# EasyEDA Pro project ProPrj_ESP32SoundBoard_2026-02-01.epro, schematic ESP32SoundBoard
Board Name: Board1; Create Date: 2026-01-03; Page Name: ESP32SoundBoard; Project Name: ESP32SoundBoard; Schematic Name: ESP32SoundBoard; Update Date: 2026-01-17; Page Size: A4; Version: V1.0
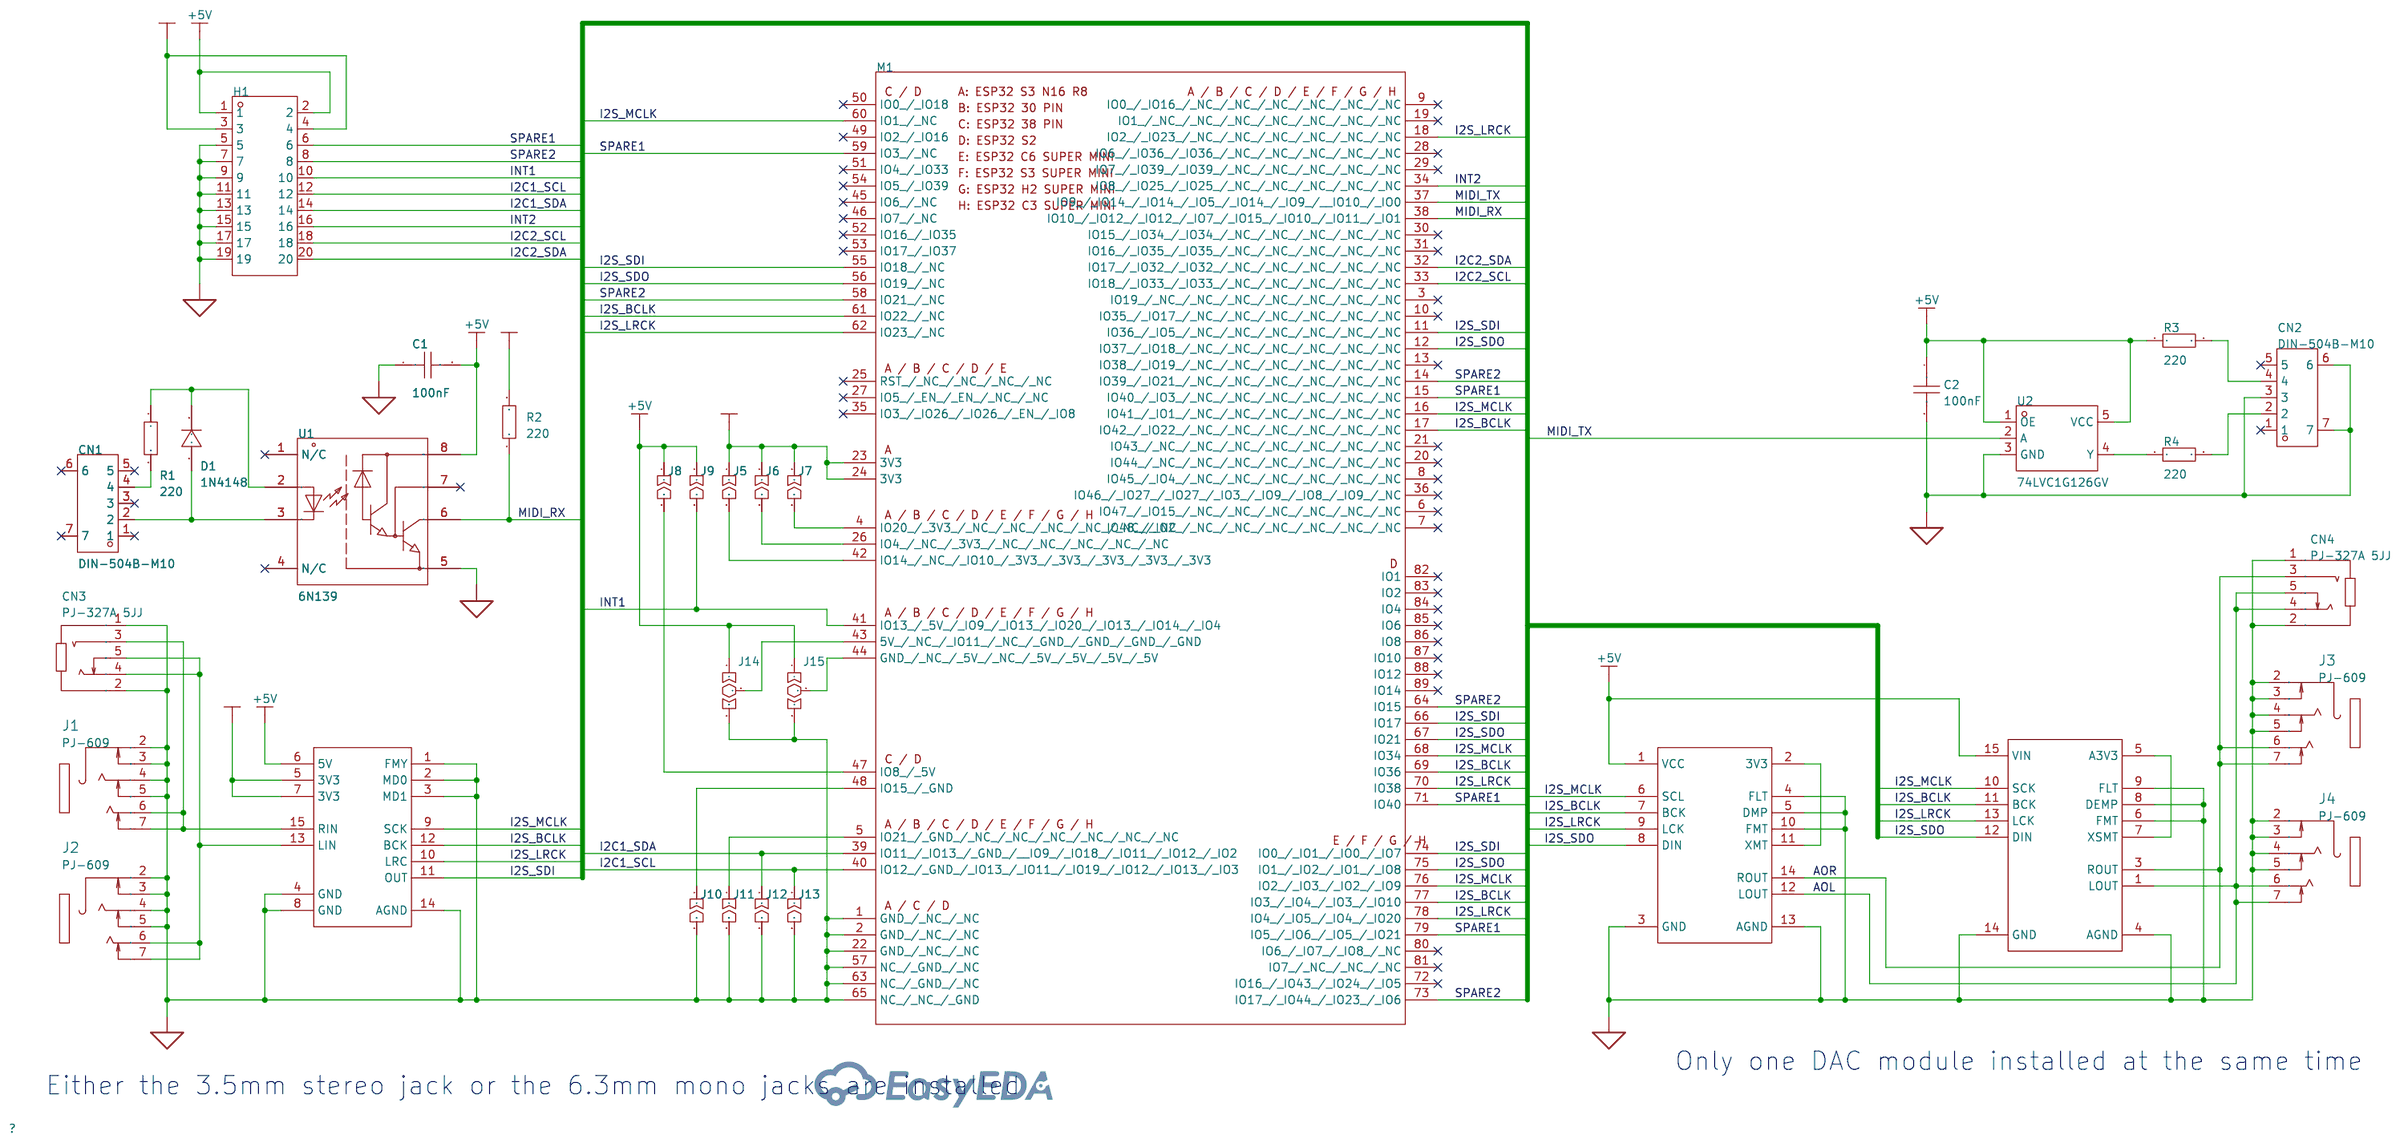
[diagram p0: schematic sheet]

## Parts
C1  100nF  [CAP-TH_L5.5-W2.4-P5.08-D0.6]
C2  100nF  [C0805]
CN1  DIN-504B-M10  [CONN-TH_DIN-504B-M10]
CN2  DIN-504B-M10  [CONN-TH_DIN-504B-M10]
CN3  PJ-327A 5JJ  [AUDIO-SMD_PJ-327A5JJ]
CN4  PJ-327A 5JJ  [AUDIO-SMD_PJ-327A5JJ]
D1  1N4148  [DO-35_BD2.0-L4.0-P8.00-D0.5-FD]
H1  -  [HDR-TH_20P-P2.54-V-M-R2-C10-S2.54]
J1  PJ-609  [AUDIO-TH_PJ-609]
J2  PJ-609  [AUDIO-TH_PJ-609]
J3  PJ-609  [AUDIO-TH_PJ-609]
J4  PJ-609  [AUDIO-TH_PJ-609]
J5  -  [Solder jumper]
J6  -  [Solder jumper]
J7  -  [Solder jumper]
J8  -  [Solder jumper]
J9  -  [Solder jumper]
J10  -  [Solder jumper]
J11  -  [Solder jumper]
J12  -  [Solder jumper]
J13  -  [Solder jumper]
J14  -  [Solder jumper 3 way]
J15  -  [Solder jumper 3 way]
M1  -  [ESP32_DEV_BOARD_MIX]
M2  PCM1808  [PCM1808_ADC_MODULE]
M3  PCM5102  [WCMCU-5102]
M4  PCM5102  [PCM5102_MODULE]
R1  10kΩ  [R_AXIAL-0.4]
R2  10kΩ  [R_AXIAL-0.4]
R3  10kΩ  [R0805]
R4  10kΩ  [R0805]
U1  6N139  [DIP-8_L9.6-W6.4-P2.54-LS7.9-BL]
U2  74LVC1G126GV  [SOT-753_L3.1-W1.7-P0.95-LS3.0-BR]

## Library data of the parts
C1 = CC1H104ZC1FD3F5O1100: Capacitance: Tolerance:-20%~+80% Tolerance:-20%~+80% Voltage Rated: Lead Spacing: Temperature Coefficient: φD: Body Thickness:2.4mm; LCSC Part Name: 100nF -20%~+80% 50V; Supplier Part: C2832508; Manufacturer: Dersonic(德尔创); Supplier Footprint: 插件,P=5.08mm; JLCPCB Part Class: Extended Part; Datasheet: https://atta.szlcsc.com/upload/public/pdf/source/20211027/6BE094CC11F3C85D18CFEA066D7024CD.pdf; Supplier: LCSC; Tolerance: -20%~+80%; Body Thickness: 2.4mm
C2 = CAP_0603: Supplier Footprint: 0603
CN1 CN2 = DIN-504B-M10: Supplier Part: C2939346; Manufacturer: HOOYA(皓宇电子); Supplier Footprint: 插件; JLCPCB Part Class: Extended Part; Datasheet: https://atta.szlcsc.com/upload/public/pdf/source/20220120/ABB2570656C6359DBC61E5C1017AC323.pdf; Supplier: LCSC
CN3 CN4 = PJ-327A 5JJ: Connector Type:3.5mm Headphone Jack Current Rating (Max):500mA Voltage Rating (Max):30V Contact Material:Copper Contact Plating:Gold Operating Temperature Range:-30℃~+70℃ Operating Temperature Range:-30℃~+70℃; LCSC Part Name: 3.5mm耳机座; Supplier Part: C668605; Manufacturer: SHOU HAN(首韩); Supplier Footprint: SMD; JLCPCB Part Class: Extended Part; Datasheet: https://atta.szlcsc.com/upload/public/pdf/source/20200618/C668605_9C1065207AFEF8C715B1238987CF5F80.pdf; Supplier: LCSC; Connector Type: 3.5mm Headphone Jack; Current Rating (Max): 500mA; Voltage Rating (Max): 30V; Contact Material: Copper; Contact Plating: Gold; Operating Temperature Range: -30℃~+70℃
D1 = 1N4148_C258182: Diode Configuration:- Voltage - Forward(Vf@If):1V@10mA Voltage - DC Reverse(Vr):100V Current - Rectified:200mA Reverse Leakage Current (Ir):5uA@75V Reverse Recovery Time (trr):4ns Operating Temperature:-55℃~+175℃@(Tj) Operating Temperature:-55℃~+175℃@(Tj); Supplier Part: C258182; Manufacturer: onsemi(安森美); Supplier Footprint: DO-35; JLCPCB Part Class: Extended Part; Datasheet: https://atta.szlcsc.com/upload/public/pdf/source/20180829/C258182_3EE2D0AB6109C1B72B054FC50B8BC8AD.pdf; Supplier: LCSC; Voltage - Forward(Vf@If): 1V@10mA; Voltage - DC Reverse(Vr): 100V; Current - Rectified: 200mA; Reverse Leakage Current (Ir): 5uA@75V; Reverse Recovery Time (trr): 4ns; Operating Temperature: -55℃~+175℃@(Tj)
H1 = HDR-M_2.54_2x10: Supplier Footprint: Through
J1-J4 = PJ-609: Connector Type:6.35mm耳机座 Current Rating (Max):1A Voltage Rating (Max):50V Operating Temperature Range:-20℃~+70℃ Operating Temperature Range:-20℃~+70℃; LCSC Part Name: 6.35mm耳机座 两件套; Supplier Part: C309274; Manufacturer: HOOYA(皓宇电子); Supplier Footprint: 插件; JLCPCB Part Class: Extended Part; Datasheet: https://atta.szlcsc.com/upload/public/pdf/source/20181226/C309274_AB77CFAA40746E22EC2996DC68F300B9.pdf; Supplier: LCSC; Connector Type: 6.35mm耳机座; Current Rating (Max): 1A; Voltage Rating (Max): 50V; Operating Temperature Range: -20℃~+70℃
J5-J13 = Solder jumper
J14 J15 = Solder jumper 3 way
M1 = ESP32_DEV_BOARD_MIX: Pin layout for a mix of ESP32 development boards that share multiple pins on the same foot print
M2 = PCM1808_ADC_Module: PCM1808 based ADC audio input module
M3 = WCMCU-5102: A PCM5102 based audio DAC module
M4 = PCM5102_Module: PCM5102 based audio DAC module
R1-R4 = Res_AXIAL-1/8W: Supplier Footprint: Through
U1 = 6N139_C5224104: Forward Voltage:1.4V Output Current:60mA Isolation Voltage(rms):5300V Number of Outputs:1 Operating Temperature:-55℃~+100℃ Operating Temperature:-55℃~+100℃; Supplier Part: C5224104; Manufacturer: VISHAY(威世); Supplier Footprint: DIP-8; JLCPCB Part Class: Extended Part; Datasheet: https://atta.szlcsc.com/upload/public/pdf/source/20221031/1E5B59C0BBF2E24895420015CB89D7D7.pdf; Supplier: LCSC; Forward Voltage: 1.4V; Output Current: 60mA; Isolation Voltage(rms): 5300V; Number of Outputs: 1; Operating Temperature: -55℃~+100℃
U2 = 74LVC1G126GV: Supplier Part: C703586; Manufacturer: Nexperia(安世); Supplier Footprint: SOT-753; JLCPCB Part Class: Extended Part; Datasheet: https://atta.szlcsc.com/upload/public/pdf/source/20200715/C703586_E6345225E39094214D3CD308CDCA878C.pdf; Supplier: LCSC

## Nets
3V3: H1.3 H1.4 J5.1 J6.1 J7.1 M1.23(3V3) M1.24(3V3) M2.5(3V3) M2.7(3V3) R2.2
+5V: C1.2 C2.1 H1.1 H1.2 J8.1 J9.1 J14.1 J15.1 M2.6(5V) M3.1(VCC) M4.15(VIN) R3.1 U1.8(VCC) U2.1(OE) U2.5(VCC)
GND: C1.1 C2.2 CN2.3 CN2.6 CN2.7 CN3.1 CN3.2 CN4.1 CN4.2 H1.5 H1.7 H1.9 H1.11 H1.13 H1.15 H1.17 H1.19 J1.2 J1.3 J1.4 J1.5 J2.2 J2.3 J2.4 J2.5 J3.2 J3.3 J3.4 J3.5 J4.2 J4.3 J4.4 J4.5 J10.2 J11.2 J12.2 J13.2 J14.3 J15.3 M1.1(GND / NC / NC) M1.2(GND / NC / NC) M1.22(GND / NC / NC) M1.57(NC / GND / NC) M1.63(NC / GND / NC) M1.65(NC / NC / GND) M2.1(FMY) M2.2(MD0) M2.3(MD1) M2.4(GND) M2.8(GND) M2.14(AGND) M3.3(GND) M3.4(FLT) M3.5(DMP) M3.10(FMT) M3.13(AGND) M4.4(AGND) M4.6(FMT) M4.8(DEMP) M4.9(FLT) M4.14(GND) U1.5(GND) U2.3(GND)
AOL: CN4.4 CN4.5 J4.6 J4.7 M3.12(LOUT) M4.1(LOUT)
AOR: CN4.3 J3.6 J3.7 M3.14(ROUT) M4.3(ROUT)
I2C1_SCL: H1.12 J13.1 M1.40(IO12 / GND / IO13 / IO11 / IO19 / IO12 / IO13 / IO3)
I2C1_SDA: H1.14 J12.1 M1.39(IO11 / IO13 / GND /  IO9 / IO18 / IO11 / IO12 / IO2)
I2C2_SCL: H1.18 M1.33(IO18 / IO33 / IO33 / NC / NC / NC / NC / NC)
I2C2_SDA: H1.20 M1.32(IO17 / IO32 / IO32 / NC / NC / NC / NC / NC)
I2S_BCLK: M1.17(IO42 / IO22 / NC / NC / NC / NC / NC / NC) M1.61(IO22 / NC) M1.69(IO36) M1.77(IO3 / IO4 / IO3 / IO10) M2.12(BCK) M3.7(BCK) M4.11(BCK)
I2S_LRCK: M1.18(IO2 / IO23 / NC / NC / NC / NC / NC / NC) M1.62(IO23 / NC) M1.70(IO38) M1.78(IO4 / IO5 / IO4 / IO20) M2.10(LRC) M3.9(LCK) M4.13(LCK)
I2S_MCLK: M1.16(IO41 / IO1 / NC / NC / NC / NC / NC / NC) M1.60(IO1 / NC) M1.68(IO34) M1.76(IO2 / IO3 / IO2 / IO9) M2.9(SCK) M3.6(SCL) M4.10(SCK)
I2S_SDI: M1.11(IO36 / IO5 / NC / NC / NC / NC / NC / NC) M1.55(IO18 / NC) M1.66(IO17) M1.74(IO0 / IO1 / IO0 / IO7) M2.11(OUT)
I2S_SDO: M1.12(IO37 / IO18 / NC / NC / NC / NC / NC / NC) M1.56(IO19 / NC) M1.67(IO21) M1.75(IO1 / IO2 / IO1 / IO8) M3.8(DIN) M4.12(DIN)
INT1: H1.10 J9.2 M1.41(IO13 / 5V / IO9 / IO13 / IO20 / IO13 / IO14 / IO4)
INT2: H1.16 M1.34(IO8 / IO25 / IO25 / NC / NC / NC / NC / NC)
MIDI_RX: M1.38(IO10 / IO12 / IO12 / IO7 / IO15 / IO10 / IO11 / IO1) R2.1 U1.6(VO)
MIDI_TX: M1.37(IO9 / IO14 / IO14 / IO5 / IO14 / IO9 /  IO10 / IO0) U2.2(A)
SPARE1: H1.6 M1.15(IO40 / IO3 / NC / NC / NC / NC / NC / NC) M1.59(IO3 / NC) M1.71(IO40) M1.79(IO5 / IO6 / IO5 / IO21)
SPARE2: H1.8 M1.14(IO39 / IO21 / NC / NC / NC / NC / NC / NC) M1.58(IO21 / NC) M1.64(IO15) M1.73(IO17 / IO44 / IO23 / IO6)
$1N8448: D1.2(K) R1.1 U1.2(VF+)
$1N8617: R4.1 U2.4(Y)
$1N9304: CN1.4 R1.2
$1N9313: CN1.2 D1.1(A) U1.3(VF-)
$1N9335: CN2.4 R3.2
$1N9340: CN2.2 R4.2
$1N10058: M3.2(3V3) M3.11(XMT)
$1N10064: M4.5(A3V3) M4.7(XSMT)
$1N10608: CN3.3 J1.6 J1.7 M2.15(RIN)
$1N10635: CN3.4 CN3.5 J2.6 J2.7 M2.13(LIN)
$1N57894: J7.2 M1.4(IO20 / 3V3 / NC / NC / NC / NC / NC / NC)
$1N57899: J6.2 M1.26(IO4 / NC / 3V3 / NC / NC / NC / NC / NC)
$1N57905: J5.2 M1.42(IO14 / NC / IO10 / 3V3 / 3V3 / 3V3 / 3V3 / 3V3)
$1N58212: J8.2 M1.47(IO8 / 5V)
$1N58220: J15.2 M1.44(GND / NC / 5V / NC / 5V / 5V / 5V / 5V)
$1N58226: J14.2 M1.43(5V / NC / IO11 / NC / GND / GND / GND / GND)
$1N59131: J11.1 M1.5(IO21 / GND / NC / NC / NC / NC / NC / NC)
$1N59137: J10.1 M1.48(IO15 / GND)

Not connected (* = marked no-connect by the designer): CN1 1* 3* 5* 6* 7*; CN2 1* 5*; M1 3(IO19 / NC / NC / NC / NC / NC / NC / NC)* 6(IO47 / IO15 / NC / NC / NC / NC / NC / NC)* 7(IO48 / IO2 / NC / NC / NC / NC / NC / NC)* 8(IO45 / IO4 / NC / NC / NC / NC / NC / NC)* 9(IO0 / IO16 / NC / NC / NC / NC / NC / NC)* 10(IO35 / IO17 / NC / NC / NC / NC / NC / NC)* 13(IO38 / IO19 / NC / NC / NC / NC / NC / NC)* 19(IO1 / NC / NC / NC / NC / NC / NC / NC)* 20(IO44 / NC / NC / NC / NC / NC / NC / NC)* 21(IO43 / NC / NC / NC / NC / NC / NC / NC)* 25(RST / NC / NC / NC / NC)* 27(IO5 / EN / EN / NC / NC)* 28(IO6 / IO36 / IO36 / NC / NC / NC / NC / NC)* 29(IO7 / IO39 / IO39 / NC / NC / NC / NC / NC)* 30(IO15 / IO34 / IO34 / NC / NC / NC / NC / NC)* 31(IO16 / IO35 / IO35 / NC / NC / NC / NC / NC)* 35(IO3 / IO26 / IO26 / EN / IO8)* 36(IO46 / IO27 / IO27 / IO3 / IO9 / IO8 / IO9 / NC)* 45(IO6 / NC)* 46(IO7 / NC)* 49(IO2 / IO16)* 50(IO0 / IO18)* 51(IO4 / IO33)* 52(IO16 / IO35)* 53(IO17 / IO37)* 54(IO5 / IO39)* 72(IO16 / IO43 / IO24 / IO5)* 80(IO6 / IO7 / IO8 / NC)* 81(IO7 / NC / NC / NC)* 82(IO1)* 83(IO2)* 84(IO4)* 85(IO6)* 86(IO8)* 87(IO10)* 88(IO12)* 89(IO14)*; U1 1(N/C)* 4(N/C)* 7(VB)*

## Notes on the sheet
- Only one DAC module installed at the same time
- Either the 3.5mm stereo jack or the 6.3mm mono jacks are installed
